# Altium schematic sheet MotorTest.SchDoc
size A4
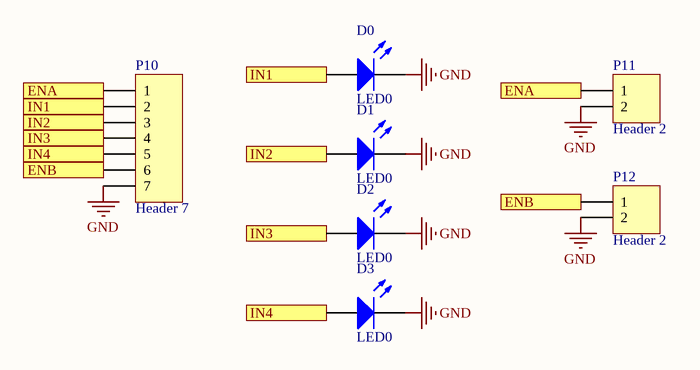
[diagram p0: MotorTest.SchDoc]

## Parts
D0  LED0  [LED-0]
D1  LED0  [LED-0]
D2  LED0  [LED-0]
D3  LED0  [LED-0]
P10  Header 7  [HDR1X7]
P11  Header 2  [HDR1X2]
P12  Header 2  [HDR1X2]

## Ports
ENA, ENB, IN1, IN2, IN3, IN4

## Nets
GND: D0.2(K) D1.2(K) D2.2(K) D3.2(K) P10.7 P11.2 P12.2
ENA: P10.1 P11.1 ; port ENA
ENB: P10.6 P12.1 ; port ENB
IN1: D0.1(A) P10.2 ; port IN1
IN2: D1.1(A) P10.3 ; port IN2
IN3: D2.1(A) P10.4 ; port IN3
IN4: D3.1(A) P10.5 ; port IN4

## Library data of the parts
D0-D3 = LED0: Typical INFRARED GaAs LED; Published: 8-Jun-2000; LatestRevisionDate: 08-Jul-2005; LatestRevisionNote: Mech Layer 1 removed.; PackageReference: LED-0; Publisher: Altium Limited; PackageDescription: LED; 2 Leads
P10 = Header 7: Header, 7-Pin; LatestRevisionDate: 17-Jul-2002; LatestRevisionNote: Re-released for DXP Platform.; Publisher: Altium Limited
P11 P12 = Header 2: Header, 2-Pin; LatestRevisionDate: 17-Jul-2002; LatestRevisionNote: Re-released for DXP Platform.; Publisher: Altium Limited